# EAGLE design up-hdmi (EAGLE 6.6.0)
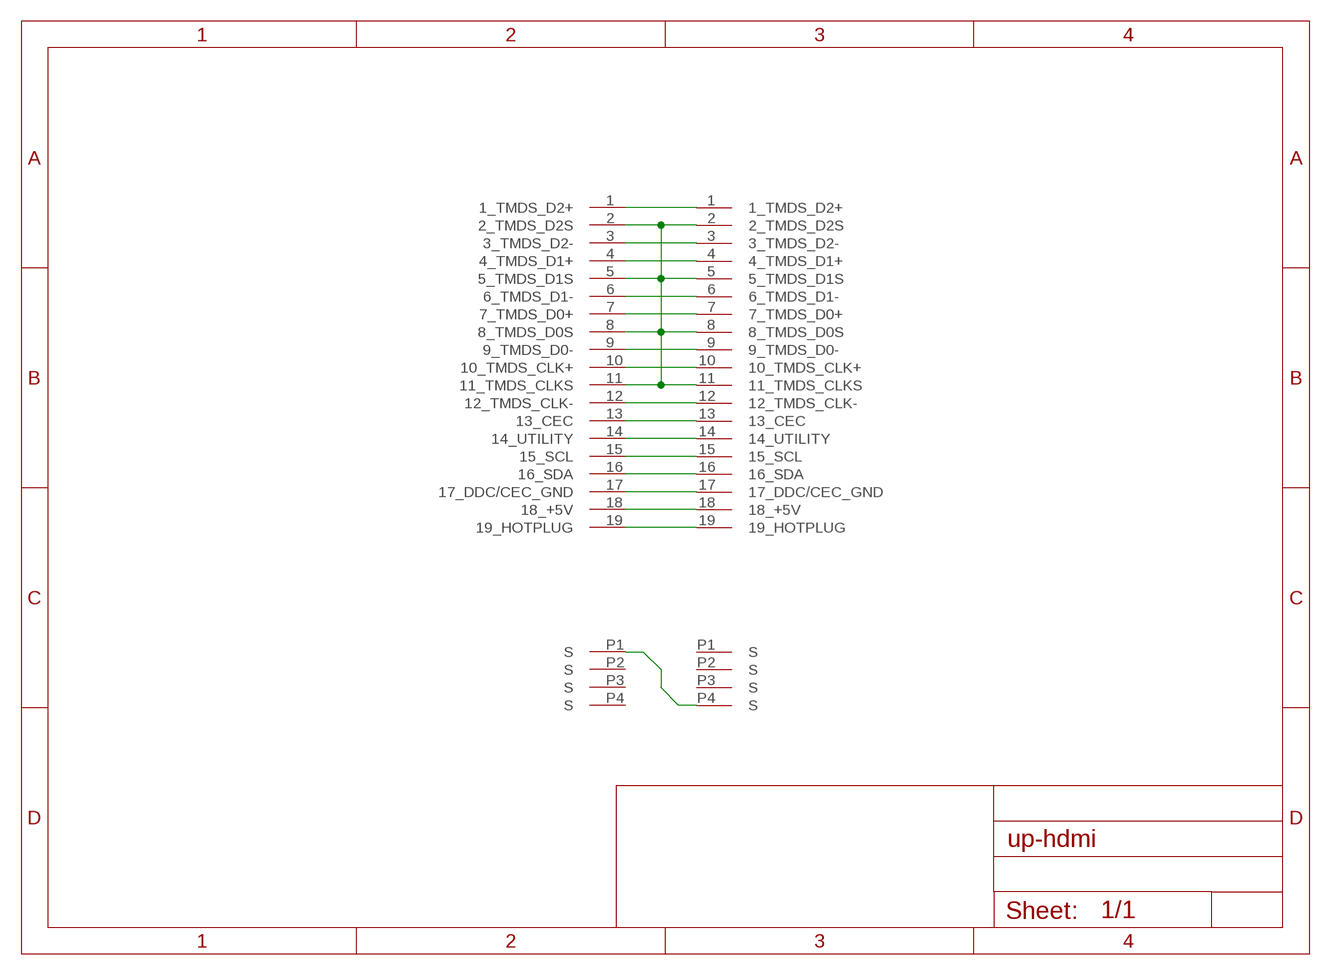
[diagram p0: schematic, sheet 1]

## Parts
CON1  HDMI_MALE  [HDMI-MALE]
CON2  HDMI_MALE  [HDMI-MALE]

## Nets
N$1: CON1.1(C:1_TMDS_D2+) CON2.1(C:1_TMDS_D2+)
N$2: CON1.P1(S1:S) CON2.P4(S4:S)
N$3: CON1.3(C:3_TMDS_D2-) CON2.3(C:3_TMDS_D2-)
N$4: CON1.4(C:4_TMDS_D1+) CON2.4(C:4_TMDS_D1+)
N$6: CON1.6(C:6_TMDS_D1-) CON2.6(C:6_TMDS_D1-)
N$7: CON1.7(C:7_TMDS_D0+) CON2.7(C:7_TMDS_D0+)
N$9: CON1.9(C:9_TMDS_D0-) CON2.9(C:9_TMDS_D0-)
N$10: CON1.10(C:10_TMDS_CLK+) CON2.10(C:10_TMDS_CLK+)
N$12: CON1.12(C:12_TMDS_CLK-) CON2.12(C:12_TMDS_CLK-)
N$13: CON1.13(C:13_CEC) CON2.13(C:13_CEC)
N$14: CON1.14(C:14_UTILITY) CON2.14(C:14_UTILITY)
N$15: CON1.15(C:15_SCL) CON2.15(C:15_SCL)
N$16: CON1.16(C:16_SDA) CON2.16(C:16_SDA)
N$17: CON1.17(C:17_DDC/CEC_GND) CON2.17(C:17_DDC/CEC_GND)
N$18: CON1.18(C:18_+5V) CON2.18(C:18_+5V)
N$19: CON1.19(C:19_HOTPLUG) CON2.19(C:19_HOTPLUG)
SHEILD: CON1.2(C:2_TMDS_D2S) CON1.5(C:5_TMDS_D1S) CON1.8(C:8_TMDS_D0S) CON1.11(C:11_TMDS_CLKS) CON2.2(C:2_TMDS_D2S) CON2.5(C:5_TMDS_D1S) CON2.8(C:8_TMDS_D0S) CON2.11(C:11_TMDS_CLKS)
Unconnected: CON1.P2(S2:S) CON1.P3(S3:S) CON1.P4(S4:S) CON2.P1(S1:S) CON2.P2(S2:S) CON2.P3(S3:S)

## Library data of the parts
CON1 CON2 = hdmi:HDMI_MALE

## Board
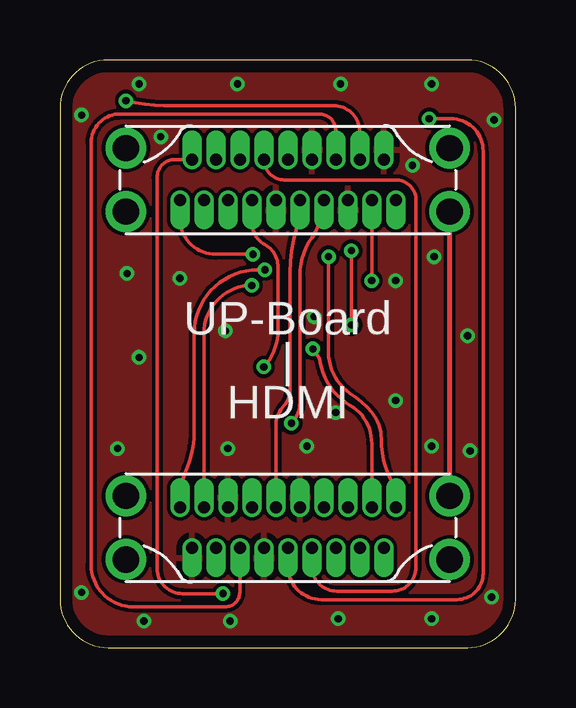
[diagram p1: board, top side]
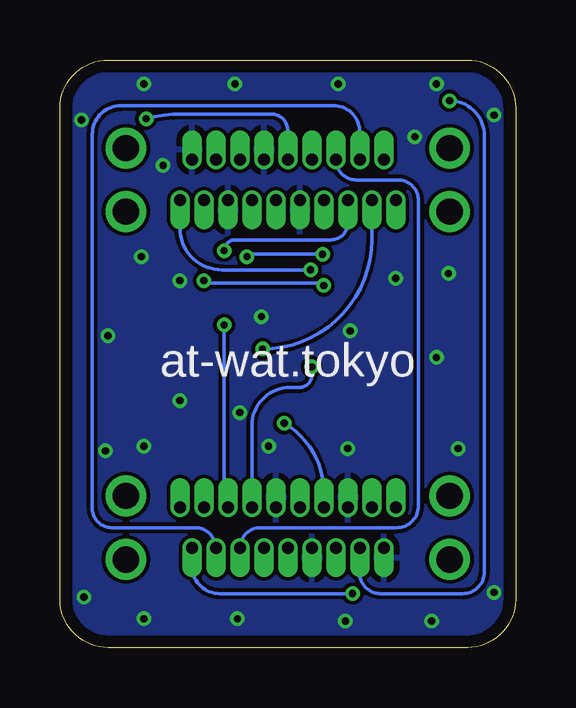
[diagram p2: board, bottom side, seen from below]

Size 19 x 24.5 mm. Coordinates in mm from the lower left corner, seen from the top.
Outline: 2,0 17,0 arc90 19,2 19,22.5 arc90 17,24.5 2,24.5 arc90 0,22.5 0,2 arc90 2,0
Copper layers (1*16): Top 0.035mm / dielectric 1.6mm / Bottom 0.035mm
Design rules "Elecrow_2-layer_PCB_eagle_rule": minimum track width 6mil, minimum drill 0.3mm, track to track 6mil, track to pad 6mil, pad to pad 6mil, via to via 8mil, smd to smd 0mil, copper to edge 20mil, drill to drill 10mil, minimum pad ring 6mil, minimum via ring 6mil, stop-mask expansion 0mil, vias tented up to drill 100mil, thermal gap 10mil

### Footprints (pad centres in the part's own frame; a part is rotated, then mirrored left to right if it is on the bottom)
HDMI-MALE = drill 0.5 pad 0.8 offset: 1 -4.5,0.85; 2 -4,-0.85; 3 -3.5,0.85; 4 -3,-0.85; 5 -2.5,0.85; 6 -2,-0.85; 7 -1.5,0.85; 8 -1,-0.85; 9 -0.5,0.85; 10 0,-0.85; 11 0.5,0.85; 12 1,-0.85; 13 1.5,0.85; 14 2,-0.85; 15 2.5,0.85; 16 3,-0.85; 17 3.5,0.85; 18 4,-0.85; 19 4.5,0.85 | drill 1.1 pad 1.7: P1 6.75,1.325; P2 6.75,-1.325; P3 -6.75,-1.325; P4 -6.75,1.325

### Placement (x,y rotation side)
CON1  9.5,5 0 top
CON2  9.5,19.5 180 top

### Tracks (layer width: path | path; a pad name or v marks a point on that pad's centre or on a via)
N$1  (via drill 0.3)
  Top 0.153: v8.55,15.75 8.25,15.75 arc90 5.6,13.1 5.6,9 arc-23 5.3,7.5 arc25 CON1.1
  Bottom 0.153: v8.55,15.75 12.25,15.75 arc90 14,17.5 CON2.1
N$2
  Top 0.2: CON1.P1 CON2.P4
N$3  (via drill 0.3)
  Top 0.153: CON2.3 v13,15.3 | v8,15.1 arc90 6,13.1 CON1.3
  Bottom 0.153: v13,15.3 12.9,15.2 8.1,15.2 arc90 v8,15.1
N$4  (via drill 0.3)
  Top 0.153: CON2.4 12.5,21.5 arc90 11.4,22.6 4.35,22.6 arc-14 v2.75,22.8
  Bottom 0.153: v2.75,22.8 arc90 1.3,21.35 1.3,3.15 arc90 2.2,2.25 5.65,2.25 arc90 6.5,3.1 CON1.4
N$6
  Top 0.153: CON2.6 11.5,21.55 arc90 10.8,22.25 2.5,22.25 arc90 1.3,21.05 1.3,3.45 arc90 3.05,1.7 6.9,1.7 arc90 7.5,2.3 CON1.6
N$7  (via drill 0.3)
  Top 0.153: CON2.7 arc-34 10.5,17.1 arc35 10,15.5 10,10.2 arc-45 v9.65,9.35
  Bottom 0.153: CON1.7 8,6.5 arc-60 v9.65,9.35
N$9
  Top 0.153: CON1.9 9,9.2 arc-43 9.35,10.1 arc46 9.6,10.8 9.6,15.65 arc-16 9.85,17.4 arc19 CON2.9
N$10  (via drill 0.3)
  Top 0.153: v15.4,22.05 16.3,22.05 arc-90 17.65,20.7 17.65,3.1 arc-90 16.55,2 10.9,2 arc-90 9.5,3.4 CON1.10
  Bottom 0.153: CON2.10 9.5,21.55 arc-90 10.2,22.25 13.9,22.25 arc-15 v15.4,22.05
N$12
  Top 0.153: CON2.12 arc90 9.35,19.5 14,19.5 arc-90 14.85,18.65 14.85,3.35 arc-90 13.85,2.35 11.55,2.35 arc-90 10.5,3.4 CON1.12
N$13  (via drill 0.3)
  Top 0.153: CON2.13 8,17.9 arc67 8.55,16.8 arc-60 9.1,15.85 9.1,13.25 arc-42 v8.5,11.7
  Bottom 0.153: CON1.13 11,9.25 arc90 9.4,10.85 9,10.85 arc-90 8.5,11.35 v8.5,11.7
N$14
  Bottom 0.153: CON1.14 arc90 10.65,5 4.95,5 arc-90 4.05,5.9 4.05,18.65 arc-90 4.9,19.5 6.65,19.5 arc90 CON2.14
N$15  (via drill 0.3)
  Top 0.153: v12.15,16.55 v12.15,13.45
  Bottom 0.153: v12.15,13.45 12.15,6 CON1.15 | CON2.15 7,17.7 arc90 7.7,17 11.7,17 arc-90 v12.15,16.55
N$16
  Bottom 0.153: CON2.16 6.5,21.5 arc-90 7.6,22.6 16.45,22.6 arc-90 17.65,21.4 17.65,5.8 arc-90 16.85,5 13.35,5 arc90 CON1.16
N$17  (via drill 0.3)
  Top 0.153: v10.55,12.45 10.7,12.25 arc-27 10.85,11.9 arc51 12.1,10.1 arc-61 13,8.5 CON1.17
  Bottom 0.153: CON2.17 6,17 arc90 v10.55,12.45
N$18  (via drill 0.3)
  Top 0.153: v6.8,2.25 5.1,2.25 arc-90 4.05,3.3 4.05,19.6 arc-90 4.8,20.35 CON2.18
  Bottom 0.153: v6.8,2.25 12.35,2.25 arc90 13.5,3.4 CON1.18
N$19  (via drill 0.3)
  Top 0.153: CON2.19 5,17.9 arc90 6.5,16.4 v8.05,16.4 | v11.2,16.3 11.2,12.3 arc56 12.1,10.6 arc-15 13,9.8 arc-42 13.4,8.7 arc28 13.8,7 arc-35 CON1.19
  Bottom 0.153: v8.05,16.4 11.1,16.4 v11.2,16.3
SHEILD  (via drill 0.3)
  other vias: 2.8,15.6 2.4,8.3 7,8.3 5,15.4 14,15.3 14,10.3 10.3,8.4 11.5,9.8 10.6,13.8 6.9,13.2 17.1,8.2 15.6,16.3 15.5,23.5 3.3,23.5 0.9,22.2 0.9,2.3 3.5,1.1 7.1,1.1 15.5,1.2 18,2.1 11.6,1.2 18.1,22 11.7,23.5 7.4,23.5 17,13 3.3,12.1 4.2,21.3 14.7,20.1 15.5,8.4
  pour Bottom: 0,24.5 19,24.5 19,0 0,0
  pour Top: 0,24.5 19,24.5 19,0 0,0

### Text on the board
tPlace: UP-Board / | / HDMI
bPlace: at-wat.tokyo